# Altium schematic sheet Air Data Controller_2021-07-25.schdoc
size 549 x 309 mm
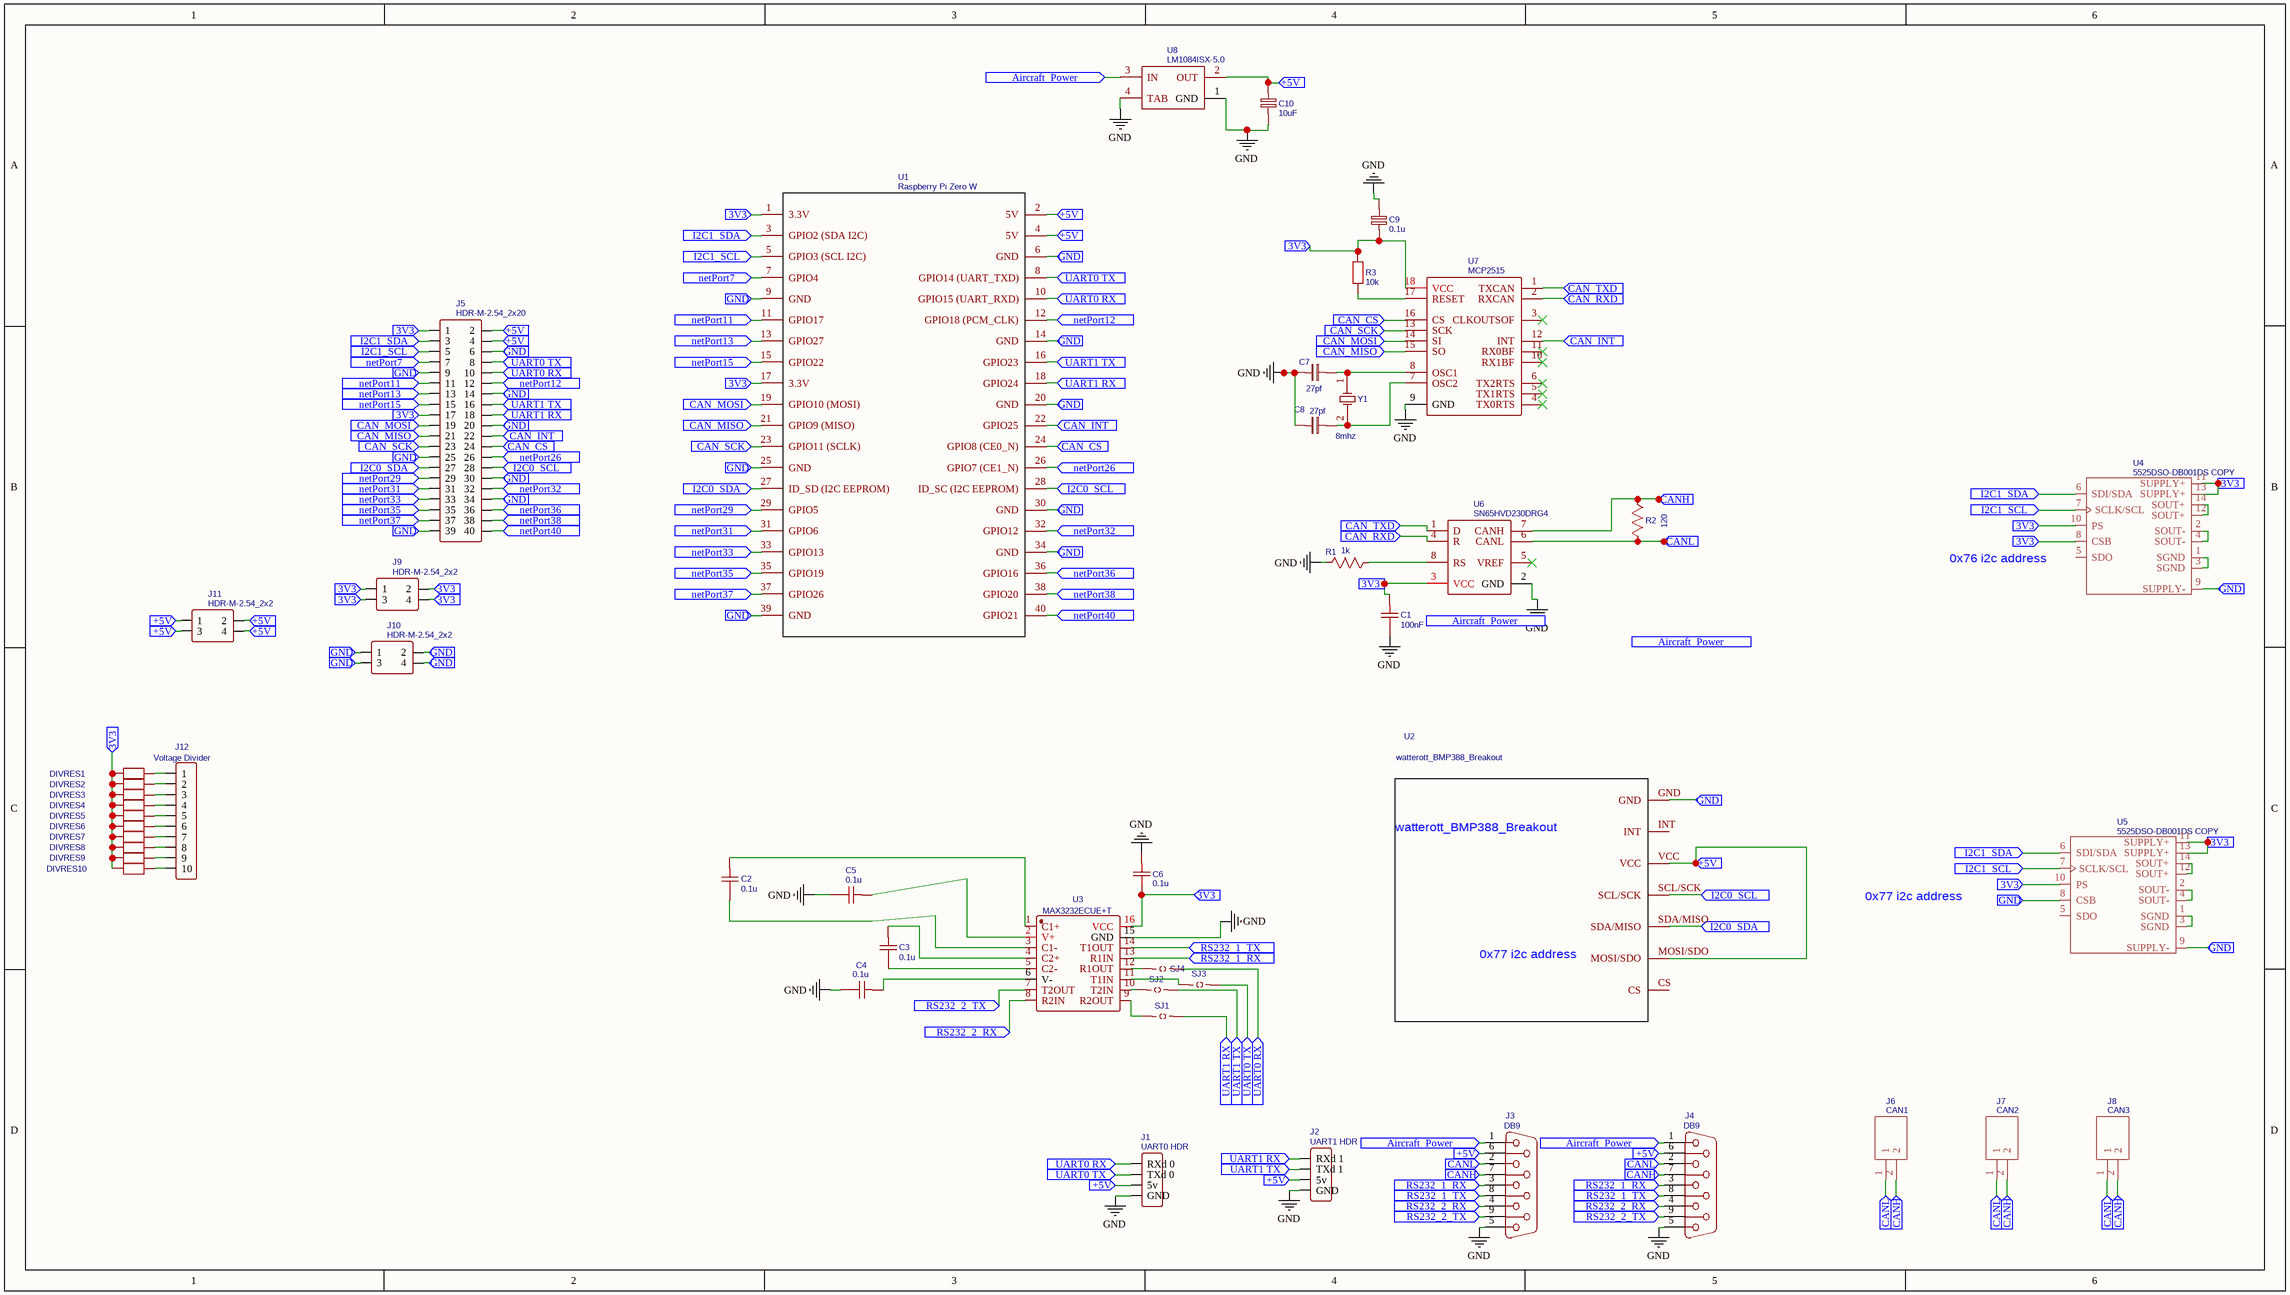
[diagram p0: Air Data Controller_2021-07-25.schdoc]

## Parts
C1  100nF  [C0805]
C2  0.1u  [C0805]
C3  0.1u  [C0805]
C4  0.1u  [C0805]
C5  0.1u  [C0805]
C6  0.1u  [C0805]
C7  27pf  [C0805]
C8  27pf  [C0805]
C9  0.1u  [C0805]
C10  10uF  [C0805]
DIVRES1  Divider Resistor  [R0805]  (value not drawn)
DIVRES2  Divider Resistor  [R0805]  (value not drawn)
DIVRES3  Divider Resistor  [R0805]  (value not drawn)
DIVRES4  Divider Resistor  [R0805]  (value not drawn)
DIVRES5  Divider Resistor  [R0805]  (value not drawn)
DIVRES6  Divider Resistor  [R0805]  (value not drawn)
DIVRES7  Divider Resistor  [R0805]  (value not drawn)
DIVRES8  Divider Resistor  [R0805]  (value not drawn)
DIVRES9  Divider Resistor  [R0805]  (value not drawn)
DIVRES10  Divider Resistor  [R0805]  (value not drawn)
J1  UART0 HDR  [HDR-M-2.54_1X4]
J2  UART1 HDR  [HDR-M-2.54_1X4]
J3  DB9  [DB9]
J4  DB9  [DB9]
J5  HDR-M-2.54_2x20  [HDR-M-2.54_2X20]
J6  CAN1  [SHDR2W100P0X350_1X2_700X1120X1]
J7  CAN2  [SHDR2W100P0X350_1X2_700X1120X1]
J8  CAN3  [SHDR2W100P0X350_1X2_700X1120X1]
J9  HDR-M-2.54_2x2  [HDR-M-2.54_2X2]
J10  HDR-M-2.54_2x2  [HDR-M-2.54_2X2]
J11  HDR-M-2.54_2x2  [HDR-M-2.54_2X2]
J12  Voltage Divider  [HDR-M-2.54_1X10]
R1  1k  [R0805]
R2  120  [R0805]
R3  10k  [R0805]
SJ1  UART1 RX jmp  [SJ_2S-NO]  (value not drawn)
SJ2  UART1 TX jmp  [SJ_2S-NO]  (value not drawn)
SJ3  UART0 TX jmp  [SJ_2S-NO]  (value not drawn)
SJ4  UART0 RX jmp  [SJ_2S-NO]  (value not drawn)
U1  Raspberry Pi Zero W  [RASPBERRY PI ZERO]
U2  watterott_BMP388_Breakout  [WATTEROTT_BMP388_BREAKOUT]
U3  MAX3232ECUE+T  [TSSOP-16_L5.0-W4.4-P0.65-LS6.4-BL]
U4  5525DSO-DB001DS COPY  [TE_5525DSO-DB001DS COPY 2]
U5  5525DSO-DB001DS COPY  [TE_5525DSO-DB001DS COPY 2]
U6  SN65HVD230DRG4  [SN65HVD230DR]
U7  MCP2515  [18-DIP]
U8  LM1084ISX-5.0  [TS3B]
Y1  8mhz  [HC-49U]

## Ports
3V3 (in), +5V (in), Aircraft_Power (in), CAN_CS (in), CAN_INT (in), CAN_MISO (in), CAN_MOSI (in), CAN_RXD (in), CAN_SCK (in), CAN_TXD (in), CANH (in), CANL (in), GND (in), I2C0_SCL (in), I2C0_SDA (in), I2C1_SCL (in), I2C1_SDA (in), netPort7 (in), netPort11 (in), netPort12 (in), netPort13 (in), netPort15 (in), netPort26 (in), netPort29 (in), netPort31 (in), netPort32 (in), netPort33 (in), netPort35 (in), netPort36 (in), netPort37 (in), netPort38 (in), netPort40 (in), RS232_1_RX (in), RS232_1_TX (in), RS232_2_RX (in), RS232_2_TX (in), UART0 RX (in), UART0 TX (in), UART1 RX (in), UART1 TX (in)

## Nets
GND: C1.1 C4.1 C5.1 C6.2 C7.1 C8.1 C9.2 C10.2 J1.4(GND) J2.4(GND) J3.5 J4.5 R1.1 U3.15(GND) U6.2(GND) U7.9(GND) U8.1(GND) U8.4(TAB)
3V3: C1.2 C6.1 C9.1 DIVRES1.1 DIVRES2.1 DIVRES3.1 DIVRES4.1 DIVRES5.1 DIVRES6.1 DIVRES7.1 DIVRES8.1 DIVRES9.1 DIVRES10.1 J5.1 J5.17 J9.1 J9.2 J9.3 J9.4 R3.2 U1.1(3.3V) U1.17(3.3V) U3.16(VCC) U4.8(CSB) U4.10(PS) U4.11(SUPPLY+) U4.13(SUPPLY+) U5.10(PS) U5.11(SUPPLY+) U5.13(SUPPLY+) U6.3(VCC) U7.18(VCC) ; port 3V3
+5V: C10.1 J1.3(5v) J2.3(5v) J3.6 J4.6 J5.2 J5.4 J11.1 J11.2 J11.3 J11.4 U1.2(5V) U1.4(5V) U2.MOSI/SDO U2.VCC U8.2(OUT) ; port +5V
Aircraft_Power: J3.1 J4.1 U8.3(IN) ; port Aircraft_Power
CAN_CS: J5.24 U1.24(GPIO8_(CE0_N)) U7.16(CS) ; port CAN_CS
CAN_INT: J5.22 U1.22(GPIO25) U7.12(INT) ; port CAN_INT
CAN_MISO: J5.21 U1.21(GPIO9_(MISO)) U7.15(SO) ; port CAN_MISO
CAN_MOSI: J5.19 U1.19(GPIO10_(MOSI)) U7.14(SI) ; port CAN_MOSI
CAN_RXD: U6.4(R) U7.2(RXCAN) ; port CAN_RXD
CAN_SCK: J5.23 U1.23(GPIO11_(SCLK)) U7.13(SCK) ; port CAN_SCK
CAN_TXD: U6.1(D) U7.1(TXCAN) ; port CAN_TXD
CANH: J3.7 J4.7 J6.2 J7.2 J8.2 R2.2 U6.7(CANH) ; port CANH
CANL: J3.2 J4.2 J6.1 J7.1 J8.1 R2.1 U6.6(CANL) ; port CANL
GND: J5.6 J5.9 J5.14 J5.20 J5.25 J5.30 J5.34 J5.39 J10.1 J10.2 J10.3 J10.4 U1.6(GND) U1.9(GND) U1.14(GND) U1.20(GND) U1.25(GND) U1.30(GND) U1.34(GND) U1.39(GND) U2.GND U4.9(SUPPLY-) U5.8(CSB) U5.9(SUPPLY-) ; port GND  [a separate net that carries the same name]
I2C0_SCL: J5.28 U1.28(ID_SC_(I2C_EEPROM)) U2.SCL/SCK ; port I2C0_SCL
I2C0_SDA: J5.27 U1.27(ID_SD_(I2C_EEPROM)) U2.SDA/MISO ; port I2C0_SDA
I2C1_SCL: J5.5 U1.5(GPIO3_(SCL_I2C)) U4.7(SCLK/SCL) U5.7(SCLK/SCL) ; port I2C1_SCL
I2C1_SDA: J5.3 U1.3(GPIO2_(SDA_I2C)) U4.6(SDI/SDA) U5.6(SDI/SDA) ; port I2C1_SDA
netPort7: J5.7 U1.7(GPIO4) ; port netPort7
netPort11: J5.11 U1.11(GPIO17) ; port netPort11
netPort12: J5.12 U1.12(GPIO18_(PCM_CLK)) ; port netPort12
netPort13: J5.13 U1.13(GPIO27) ; port netPort13
netPort15: J5.15 U1.15(GPIO22) ; port netPort15
netPort26: J5.26 U1.26(GPIO7_(CE1_N)) ; port netPort26
netPort29: J5.29 U1.29(GPIO5) ; port netPort29
netPort31: J5.31 U1.31(GPIO6) ; port netPort31
netPort32: J5.32 U1.32(GPIO12) ; port netPort32
netPort33: J5.33 U1.33(GPIO13) ; port netPort33
netPort35: J5.35 U1.35(GPIO19) ; port netPort35
netPort36: J5.36 U1.36(GPIO16) ; port netPort36
netPort37: J5.37 U1.37(GPIO26) ; port netPort37
netPort38: J5.38 U1.38(GPIO20) ; port netPort38
netPort40: J5.40 U1.40(GPIO21) ; port netPort40
RS232_1_RX: J3.3 J4.3 U3.13(R1IN) ; port RS232_1_RX
RS232_1_TX: J3.8 J4.8 U3.14(T1OUT) ; port RS232_1_TX
RS232_2_RX: J3.4 J4.4 U3.8(R2IN) ; port RS232_2_RX
RS232_2_TX: J3.9 J4.9 U3.7(T2OUT) ; port RS232_2_TX
UART0 RX: J1.1(RXd_0) J5.10 SJ4.2 U1.10(GPIO15_(UART_RXD)) ; port UART0 RX
UART0 TX: J1.2(TXd_0) J5.8 SJ3.2 U1.8(GPIO14_(UART_TXD)) ; port UART0 TX
UART1 RX: J2.1(RXd_1) J5.18 SJ1.2 U1.18(GPIO24) ; port UART1 RX
UART1 TX: J2.2(TXd_1) J5.16 SJ2.2 U1.16(GPIO23) ; port UART1 TX
NetC2_1: C2.1 U3.3(C1-)
NetC2_2: C2.2 U3.1(C1+)
NetC3_1: C3.1 U3.5(C2-)
NetC3_2: C3.2 U3.4(C2+)
NetC4_2: C4.2 U3.6(V-)
NetC5_2: C5.2 U3.2(V+)
NetC7_2: C7.2 U7.8(OSC1) Y1.1(OSC1)
NetC8_2: C8.2 U7.7(OSC2) Y1.2(OSC2)
NetDIVRES1_2: DIVRES1.2 J12.1
NetDIVRES2_2: DIVRES2.2 J12.2
NetDIVRES3_2: DIVRES3.2 J12.3
NetDIVRES4_2: DIVRES4.2 J12.4
NetDIVRES5_2: DIVRES5.2 J12.5
NetDIVRES6_2: DIVRES6.2 J12.6
NetDIVRES7_2: DIVRES7.2 J12.7
NetDIVRES8_2: DIVRES8.2 J12.8
NetDIVRES9_2: DIVRES9.2 J12.9
NetDIVRES10_2: DIVRES10.2 J12.10
NetR1_2: R1.2 U6.8(RS)
NetR3_1: R3.1 U7.17(RESET)
NetSJ1_1: SJ1.1 U3.9(R2OUT)
NetSJ2_1: SJ2.1 U3.10(T2IN)
NetSJ3_1: SJ3.1 U3.11(T1IN)
NetSJ4_1: SJ4.1 U3.12(R1OUT)
NetU4_1: U4.1(SGND) U4.3(SGND)
NetU4_2: U4.2(SOUT-) U4.4(SOUT-)
NetU4_12: U4.12(SOUT+) U4.14(SOUT+)
NetU5_1: U5.1(SGND) U5.3(SGND)
NetU5_2: U5.2(SOUT-) U5.4(SOUT-)
NetU5_12: U5.12(SOUT+) U5.14(SOUT+)

Not connected (* = marked no-connect by the designer): U2 CS INT; U4 5(SDO); U5 5(SDO); U6 5(VREF)*; U7 3(CLKOUTSOF)* 4(TX0RTS)* 5(TX1RTS)* 6(TX2RTS)* 10(RX1BF)* 11(RX0BF)*

## Notes on the sheet
- 0x76 i2c address
- 0x77 i2c address

## Library data of the parts
C1 = 100nF: nameAlias: Value(F); Contributor: LCEDA_Lib; spicePre: C; spiceSymbolName: C_0805_US
C2-C6 C9 = 0.1u: nameAlias: Value(F); Contributor: LCEDA_Lib; spicePre: C
  C2-C6: spiceSymbolName: C_0805_US
  C9: spiceSymbolName: C_0805_EU
C7 C8 = 27pf: nameAlias: Value(F); Contributor: LCEDA_Lib; spicePre: C; spiceSymbolName: C_0805_EU
C10 = 10uF: nameAlias: Value(F); Contributor: LCEDA_Lib; spicePre: C; spiceSymbolName: C_0805_EU
DIVRES1-DIVRES10 = Divider Resistor: nameAlias: Value(Ω); Contributor: LCEDA_Lib; spicePre: R; spiceSymbolName: R_0805_EU
J1 = UART0 HDR: Contributor: LCEDA_Lib; BOM_Supplier Part: C124378; BOM_Supplier: LCSC; spicePre: J; spiceSymbolName: HDR-M-2.54_1x4
J2 = UART1 HDR: Contributor: LCEDA_Lib; BOM_Supplier Part: C124378; BOM_Supplier: LCSC; spicePre: J; spiceSymbolName: HDR-M-2.54_1x4
J3 J4 = DB9: Contributor: Alex_Tien; spicePre: J; spiceSymbolName: DB9
J5 = HDR-M-2.54_2x20: Contributor: LCEDA_Lib; BOM_Supplier Part: C50980; BOM_Supplier: LCSC; spicePre: J; spiceSymbolName: HDR-M-2.54_2x20
J6 = CAN1: BOM_Manufacturer Part: 1988956; BOM_Manufacturer: Phoenix Contact; Contributor: Marc-andré Morneau; BOM_Supplier: Digi-Key; BOM_Supplier Part: 277-1779-ND; link: https://www.digikey.ca/en/products/detail/phoenix-contact/1988956/950907; spicePre: J; spiceSymbolName: 1988956
J7 = CAN2: BOM_Manufacturer Part: 1988956; BOM_Manufacturer: Phoenix Contact; Contributor: Marc-andré Morneau; BOM_Supplier: Digi-Key; BOM_Supplier Part: 277-1779-ND; link: https://www.digikey.ca/en/products/detail/phoenix-contact/1988956/950907; spicePre: J; spiceSymbolName: 1988956
J8 = CAN3: BOM_Manufacturer Part: 1988956; BOM_Manufacturer: Phoenix Contact; Contributor: Marc-andré Morneau; BOM_Supplier: Digi-Key; BOM_Supplier Part: 277-1779-ND; link: https://www.digikey.ca/en/products/detail/phoenix-contact/1988956/950907; spicePre: J; spiceSymbolName: 1988956
J9-J11 = HDR-M-2.54_2x2: Contributor: LCEDA_Lib; BOM_Supplier Part: C66690; BOM_Supplier: LCSC; spicePre: J; spiceSymbolName: HDR-M-2.54_2x2
J12 = Voltage Divider: Contributor: LCEDA_Lib; BOM_Supplier Part: C57369; BOM_Supplier: LCSC; spicePre: J; spiceSymbolName: HDR-M-2.54_1x10
R1 = 1k: nameAlias: Value(Ω); Contributor: LCEDA_Lib; spicePre: R; spiceSymbolName: R_0805_US
R2 = 120: nameAlias: Value(Ω); Contributor: LCEDA_Lib; spicePre: R; spiceSymbolName: R_0805_US
R3 = 10k: nameAlias: Value(Ω); Contributor: LCEDA_Lib; spicePre: R; spiceSymbolName: R_0805_EU
SJ1 = UART1 RX jmp: description: Solder Jumper; Contributor: SparkFun; spicePre: S; spiceSymbolName: SOLDERJUMPERNO
SJ2 = UART1 TX jmp: description: Solder Jumper; Contributor: SparkFun; spicePre: S; spiceSymbolName: SOLDERJUMPERNO
SJ3 = UART0 TX jmp: description: Solder Jumper; Contributor: SparkFun; spicePre: S; spiceSymbolName: SOLDERJUMPERNO
SJ4 = UART0 RX jmp: description: Solder Jumper; Contributor: SparkFun; spicePre: S; spiceSymbolName: SOLDERJUMPERNO
U1 = Raspberry Pi Zero W: Contributor: poikl.m246; BOM_Manufacturer: Raspberry Pi Zero W; BOM_Manufacturer Part: Raspberry Pi Zero W; spicePre: U; spiceSymbolName: Raspberry Pi Zero W
U2 = watterott_BMP388_Breakout: Contributor: wmax351; BOM_Manufacturer: watterott; BOM_Supplier: Digi-Key; BOM_Supplier Part: ‎2100-20190001-ND‎; link: https://github.com/watterott/BMP388-Breakout/; spicePre: U; spiceSymbolName: watterott_BMP388_Breakout
U3 = MAX3232ECUE+T: BOM_Manufacturer: MAXIM(美信); Contributor: LCSC; BOM_Supplier: LCSC; BOM_Supplier Part: C2671534; BOM_Manufacturer Part: MAX3232ECUE+T; BOM_JLCPCB Part Class: Extended Part; spicePre: U; spiceSymbolName: MAX3232ECUE+T
U4 U5 = 5525DSO-DB001DS COPY: Contributor: ArthurD; spicePre: U; spiceSymbolName: 5525DSO-DB001DS
U6 = SN65HVD230DRG4: description: 3.3 V CAN Transceiver with Standby Mode, 17 mA, -40 to 85 degC, 8-pin SOIC (D), Green (RoHS  no SbBr); spicePre: U; spiceSymbolName: SN65HVD230DRG4
U7 = MCP2515: BOM_Manufacturer: Microchip; description: Microchip CAN Controller with SPI Interface; Contributor: samvanbrussel; BOM_Manufacturer Part: MCP2515; spicePre: U; spiceSymbolName: MCP2515
U8 = LM1084ISX-5.0: description: 5A Low Dropout Positive Regulators, 3-pin TO-263; spicePre: U; spiceSymbolName: LM1084ISX-5.0
Y1 = 8mhz: description: Crystal Oscillator; spicePre: Y; spiceSymbolName: ECS-80-20-1